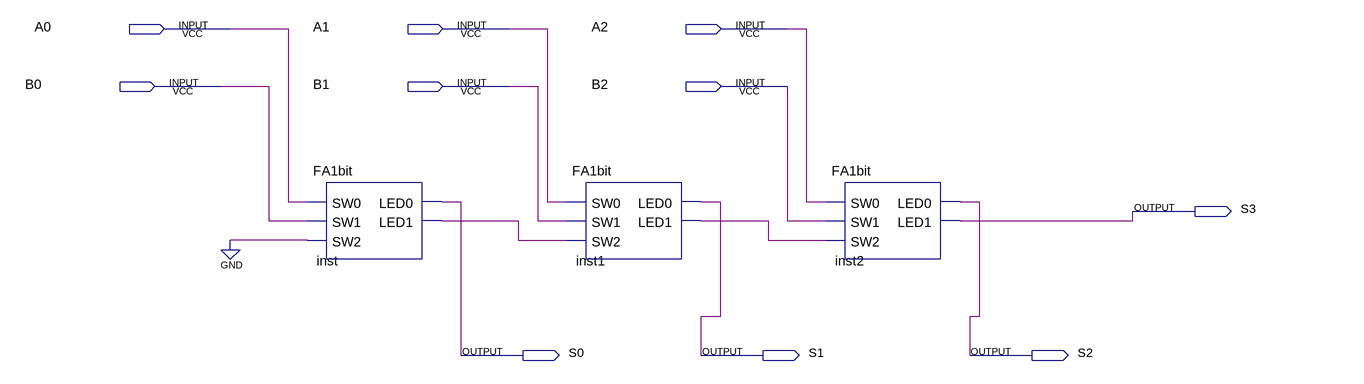
[diagram p0: schematic sheet]
// Quartus schematic exercise3.bdf as structural Verilog: 3 symbols, 10 pins
module exercise3 (
  input  A0,
  input  A1,
  input  A2,
  input  B0,
  input  B1,
  input  B2,
  output S3,
  output S0,
  output S1,
  output S2
);

  wire inst1_led1, inst_led1;

  FA1bit inst (.SW0(A0), .SW1(B0), .SW2(1'b0), .LED0(S0), .LED1(inst_led1));
  FA1bit inst1 (.SW0(A1), .SW1(B1), .SW2(inst_led1), .LED0(S1), .LED1(inst1_led1));
  FA1bit inst2 (.SW0(A2), .SW1(B2), .SW2(inst1_led1), .LED0(S2), .LED1(S3));
endmodule
